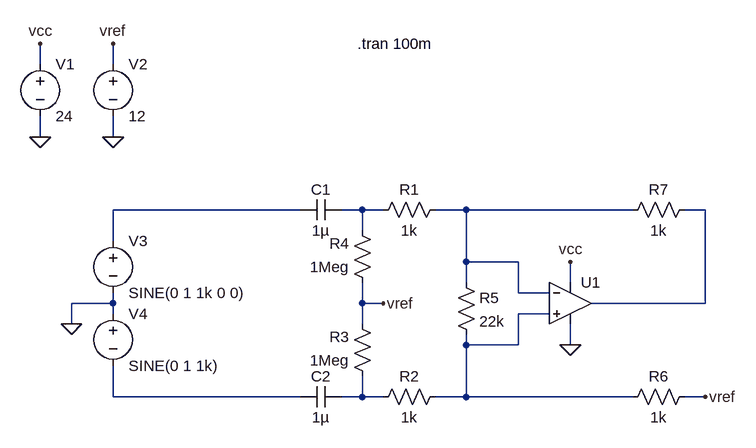
[diagram p0: schematic desym.asc]
desym.asc, the LTspice schematic file:
Version 4
SHEET 1 880 680
WIRE -576 -192 -576 -224
WIRE -464 -192 -464 -224
WIRE -576 -80 -576 -112
WIRE -464 -80 -464 -112
WIRE -176 32 -464 32
WIRE -80 32 -112 32
WIRE -48 32 -80 32
WIRE 80 32 32 32
WIRE 336 32 80 32
WIRE 448 32 416 32
WIRE -80 64 -80 32
WIRE -464 80 -464 32
WIRE 80 112 80 32
WIRE 160 112 80 112
WIRE 80 144 80 112
WIRE 240 144 240 112
WIRE 160 160 160 112
WIRE 208 160 160 160
WIRE -464 176 -464 160
WIRE -464 176 -528 176
WIRE -80 176 -80 144
WIRE -48 176 -80 176
WIRE 448 176 448 32
WIRE 448 176 272 176
WIRE -464 192 -464 176
WIRE 208 192 160 192
WIRE -528 208 -528 176
WIRE -80 208 -80 176
WIRE 80 240 80 224
WIRE 160 240 160 192
WIRE 160 240 80 240
WIRE 240 240 240 208
WIRE -464 320 -464 272
WIRE -176 320 -464 320
WIRE -80 320 -80 288
WIRE -80 320 -112 320
WIRE -48 320 -80 320
WIRE 80 320 80 240
WIRE 80 320 32 320
WIRE 336 320 80 320
WIRE 448 320 416 320
FLAG -576 -80 0
FLAG -464 -80 0
FLAG -528 208 0
FLAG -576 -224 vcc
FLAG -464 -224 vref
FLAG 448 320 vref
FLAG -48 176 vref
FLAG 240 112 vcc
FLAG 240 240 0
SYMBOL Opamps\\UniversalOpamp2 240 176 R0
SYMATTR InstName U1
SYMBOL voltage -576 -208 R0
SYMATTR InstName V1
SYMATTR Value 24
SYMBOL voltage -464 -208 R0
SYMATTR InstName V2
SYMATTR Value 12
SYMBOL voltage -464 64 R0
WINDOW 123 0 0 Left 2
WINDOW 39 0 0 Left 2
SYMATTR InstName V3
SYMATTR Value SINE(0 1 1k 0 0)
SYMBOL res 48 16 R90
WINDOW 0 0 56 VBottom 2
WINDOW 3 32 56 VTop 2
SYMATTR InstName R1
SYMATTR Value 1k
SYMBOL res 48 304 R90
WINDOW 0 0 56 VBottom 2
WINDOW 3 32 56 VTop 2
SYMATTR InstName R2
SYMATTR Value 1k
SYMBOL res -64 304 R180
WINDOW 0 36 76 Left 2
WINDOW 3 36 40 Left 2
SYMATTR InstName R3
SYMATTR Value 1Meg
SYMBOL res -64 160 R180
WINDOW 0 36 76 Left 2
WINDOW 3 36 40 Left 2
SYMATTR InstName R4
SYMATTR Value 1Meg
SYMBOL res 64 128 R0
SYMATTR InstName R5
SYMATTR Value 22k
SYMBOL res 432 304 R90
WINDOW 0 0 56 VBottom 2
WINDOW 3 32 56 VTop 2
SYMATTR InstName R6
SYMATTR Value 1k
SYMBOL res 432 16 R90
WINDOW 0 0 56 VBottom 2
WINDOW 3 32 56 VTop 2
SYMATTR InstName R7
SYMATTR Value 1k
SYMBOL cap -112 16 R90
WINDOW 0 0 32 VBottom 2
WINDOW 3 32 32 VTop 2
SYMATTR InstName C1
SYMATTR Value 1µ
SYMBOL cap -112 304 R90
WINDOW 0 0 32 VBottom 2
WINDOW 3 32 32 VTop 2
SYMATTR InstName C2
SYMATTR Value 1µ
SYMBOL voltage -464 176 R0
WINDOW 123 0 0 Left 2
WINDOW 39 0 0 Left 2
SYMATTR InstName V4
SYMATTR Value SINE(0 1 1k)
TEXT -88 -224 Left 2 !.tran 100m

The netlist it stands for:
* desym.asc
XU1 N005 N003 vcc 0 N004 level.2 Avol=1Meg GBW=10Meg Slew=10Meg ilimit=25m rail=0 Vos=0 phimargin=45 en=0 enk=0 in=0 ink=0 Rin=500Meg  ; pins IN+ IN- V+ V- OUT
V1 vcc 0 24
V2 vref 0 12
V3 N001 0 SINE(0 1 1k 0 0)
R1 N003 N002 1k
R2 N005 N007 1k
R3 N007 vref 1Meg
R4 vref N002 1Meg
R5 N003 N005 22k
R6 vref N005 1k
R7 N004 N003 1k
C1 N002 N001 1µ
C2 N007 N006 1µ
V4 0 N006 SINE(0 1 1k)
.tran 100m
.lib UniversalOpamps2.sub
.backanno
.end